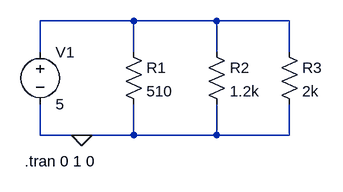
[diagram p0: schematic ScematicParallel.asc]
ScematicParallel.asc, the LTspice schematic file:
Version 4
SHEET 1 880 680
WIRE 144 80 0 80
WIRE 272 80 144 80
WIRE 384 80 272 80
WIRE 0 128 0 80
WIRE 144 128 144 80
WIRE 272 128 272 80
WIRE 384 128 384 80
WIRE 0 256 0 208
WIRE 64 256 0 256
WIRE 144 256 144 208
WIRE 144 256 64 256
WIRE 272 256 272 208
WIRE 272 256 144 256
WIRE 384 256 384 208
WIRE 384 256 272 256
FLAG 64 256 0
SYMBOL voltage 0 112 R0
WINDOW 123 0 0 Left 0
WINDOW 39 0 0 Left 0
SYMATTR InstName V1
SYMATTR Value 5
SYMBOL res 128 112 R0
SYMATTR InstName R1
SYMATTR Value 510
SYMBOL res 256 112 R0
SYMATTR InstName R2
SYMATTR Value 1.2k
SYMBOL res 368 112 R0
SYMATTR InstName R3
SYMATTR Value 2k
TEXT -24 296 Left 2 !.tran 0 1 0

The netlist it stands for:
* ScematicParallel.asc
V1 N001 0 5
R1 N001 0 510
R2 N001 0 1.2k
R3 N001 0 2k
.tran 0 1 0
.backanno
.end